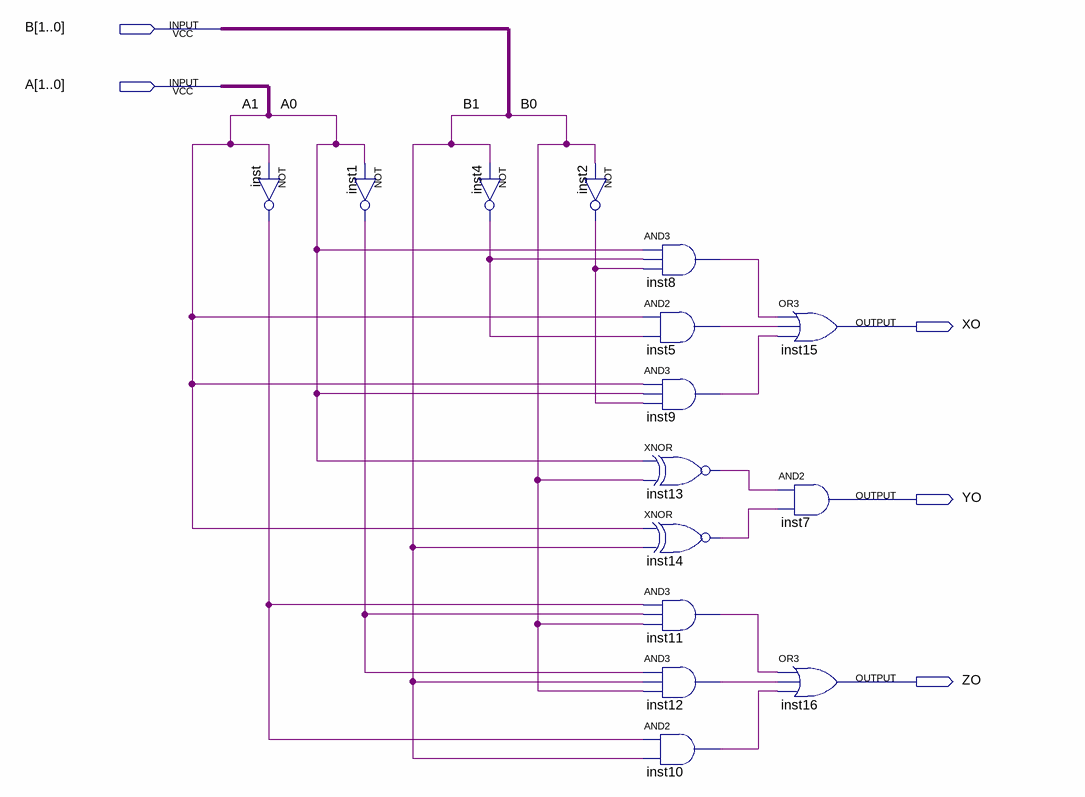
[diagram p0: schematic sheet]
// Quartus schematic twobitcomparator_sime.bdf as structural Verilog: 15 symbols, 5 pins
module twobitcomparator_sime (
  input  [1:0] B,
  input  [1:0] A,
  output XO,
  output YO,
  output ZO
);

  wire inst1_out, inst2_out, inst4_out, inst5_out, inst8_out, inst9_out, inst10_out, inst11_out, inst12_out,
       inst13_out, inst14_out, inst_out;

  not inst (inst_out, A[1]);
  not inst1 (inst1_out, A[0]);
  not inst4 (inst4_out, B[1]);
  not inst2 (inst2_out, B[0]);
  and inst8 (inst8_out, A[0], inst4_out, inst2_out);
  and inst5 (inst5_out, A[1], inst4_out);
  and inst9 (inst9_out, A[1], A[0], inst2_out);
  xnor inst13 (inst13_out, A[0], B[0]);
  xnor inst14 (inst14_out, A[1], B[1]);
  and inst11 (inst11_out, inst_out, inst1_out, B[0]);
  and inst12 (inst12_out, inst1_out, B[1], B[0]);
  and inst10 (inst10_out, inst_out, B[1]);
  or inst15 (XO, inst8_out, inst5_out, inst9_out);
  and inst7 (YO, inst13_out, inst14_out);
  or inst16 (ZO, inst11_out, inst12_out, inst10_out);
endmodule
